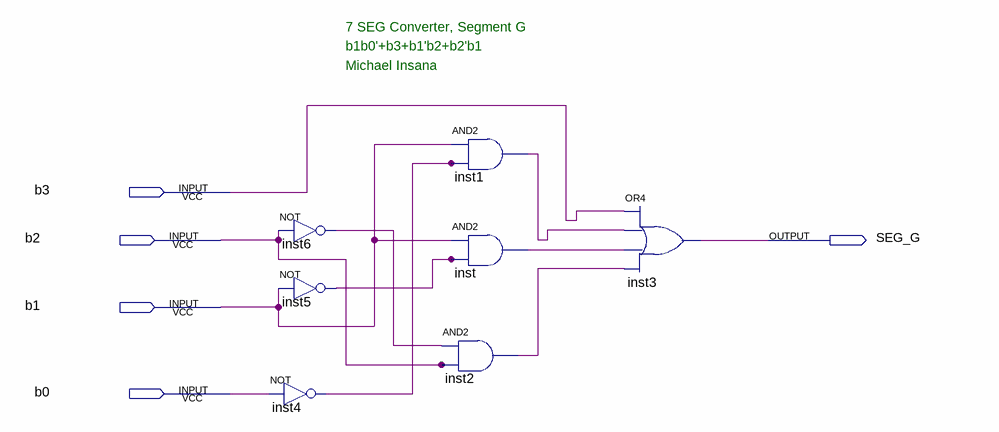
[diagram p0: schematic sheet]
// Quartus schematic BCD_7SEG_G.bdf as structural Verilog: 7 symbols, 5 pins
module BCD_7SEG_G (
  input  b3,
  input  b2,
  input  b1,
  input  b0,
  output SEG_G
);

  wire inst1_out, inst2_out, inst4_out, inst5_out, inst6_out, inst_out;

  not inst6 (inst6_out, b2);
  not inst5 (inst5_out, b1);
  not inst4 (inst4_out, b0);
  and inst1 (inst1_out, b1, inst4_out);
  and inst (inst_out, b1, inst5_out);
  and inst2 (inst2_out, inst6_out, b2);
  or inst3 (SEG_G, b3, inst1_out, inst_out, inst2_out);

  // Notes on the sheet:
  //   7 SEG Converter, Segment G
  //   b1b0'+b3+b1'b2+b2'b1
  //   Michael Insana
endmodule
